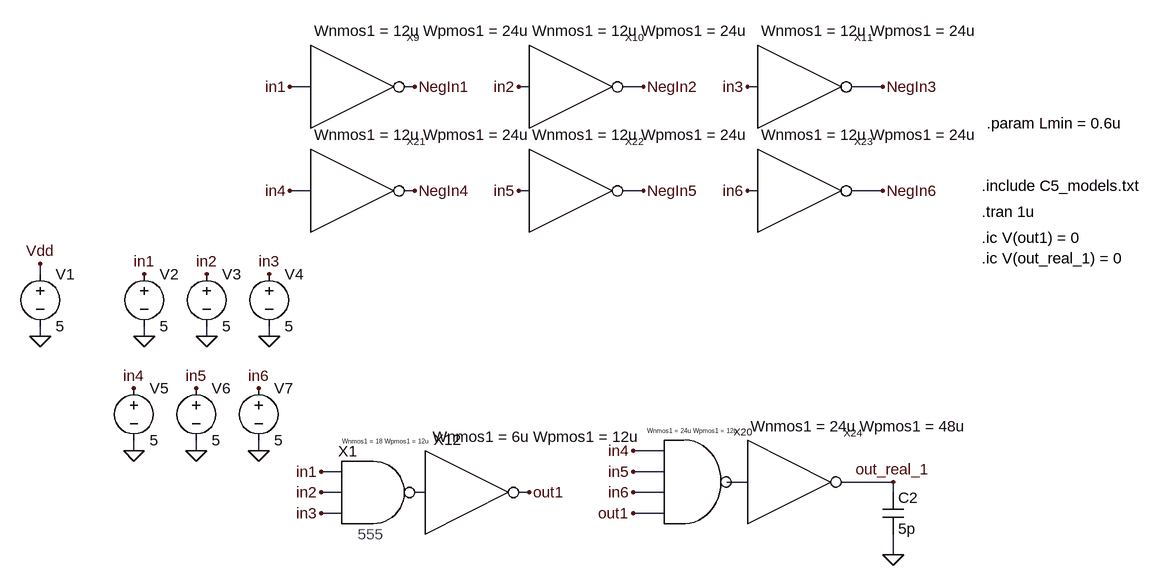
[diagram p0: schematic Decoder.asc]
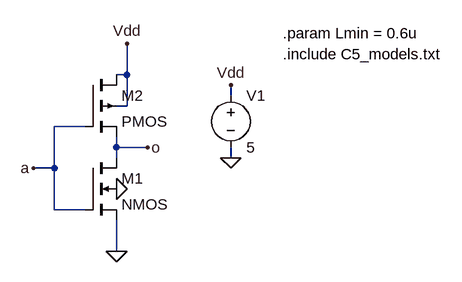
[diagram p1: sub-circuit inv.asc]
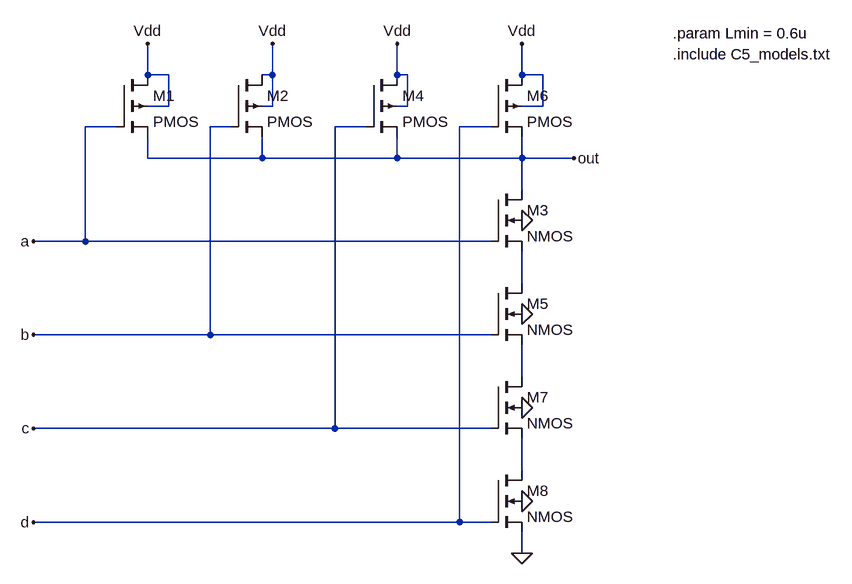
[diagram p2: sub-circuit nand4.asc]
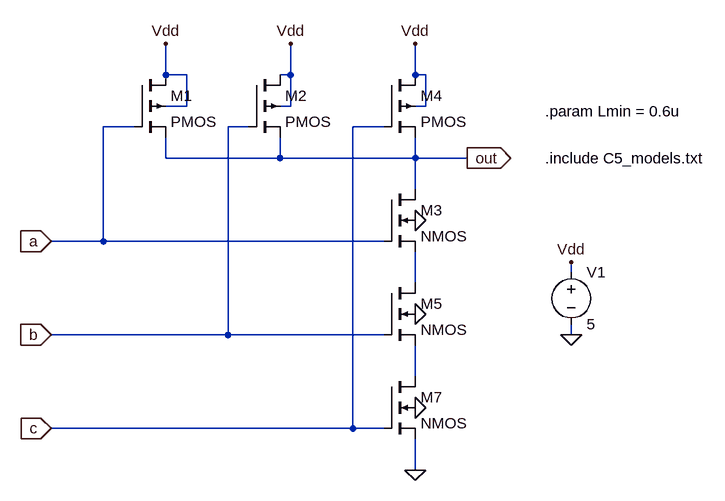
[diagram p3: sub-circuit nand3.asc]
Decoder.asc, the LTspice schematic file:
Version 4
SHEET 1 1096 1028
WIRE -800 -480 -832 -480
WIRE -640 -480 -656 -480
WIRE -464 -480 -480 -480
WIRE -288 -480 -320 -480
WIRE -112 -480 -128 -480
WIRE 80 -480 32 -480
WIRE -800 -320 -832 -320
WIRE -640 -320 -656 -320
WIRE -464 -320 -480 -320
WIRE -288 -320 -320 -320
WIRE -112 -320 -128 -320
WIRE 80 -320 32 -320
WIRE -1216 -192 -1216 -208
WIRE -1216 -96 -1216 -112
WIRE -1056 -96 -1056 -112
WIRE -960 -96 -960 -112
WIRE -864 -96 -864 -112
WIRE -1072 80 -1072 64
WIRE -976 80 -976 64
WIRE -880 80 -880 64
WIRE -256 80 -304 80
WIRE -752 112 -784 112
WIRE -256 112 -304 112
WIRE -128 128 -160 128
WIRE 96 128 16 128
WIRE -752 144 -784 144
WIRE -624 144 -640 144
WIRE -464 144 -480 144
WIRE -256 144 -304 144
WIRE 96 144 96 128
WIRE -752 176 -784 176
WIRE -256 176 -304 176
WIRE 96 240 96 208
FLAG -1056 -96 0
FLAG -1056 -192 in1
FLAG -960 -96 0
FLAG -960 -192 in2
FLAG -864 -96 0
FLAG -864 -192 in3
FLAG -464 144 out1
FLAG -784 112 in1
FLAG -784 144 in2
FLAG -784 176 in3
FLAG -1216 -96 0
FLAG -1216 -208 Vdd
FLAG -832 -480 in1
FLAG -640 -480 NegIn1
FLAG -480 -480 in2
FLAG -288 -480 NegIn2
FLAG -128 -480 in3
FLAG 80 -480 NegIn3
FLAG -1072 80 0
FLAG -1072 -16 in4
FLAG -976 80 0
FLAG -976 -16 in5
FLAG -880 80 0
FLAG -880 -16 in6
FLAG -304 80 in4
FLAG -304 112 in5
FLAG -304 144 in6
FLAG -304 176 out1
FLAG 96 128 out_real_1
FLAG -832 -320 in4
FLAG -640 -320 NegIn4
FLAG -480 -320 in5
FLAG -288 -320 NegIn5
FLAG -128 -320 in6
FLAG 80 -320 NegIn6
FLAG 96 240 0
SYMBOL voltage -1056 -208 R0
SYMATTR InstName V2
SYMATTR Value 5
SYMBOL voltage -960 -208 R0
WINDOW 123 0 0 Left 2
WINDOW 39 0 0 Left 2
SYMATTR InstName V3
SYMATTR Value 5
SYMBOL voltage -864 -208 R0
SYMATTR InstName V4
SYMATTR Value 5
SYMBOL voltage -1216 -208 R0
SYMATTR InstName V1
SYMATTR Value 5
SYMBOL INV -752 -480 R0
SYMATTR InstName X9
SYMBOL INV -416 -480 R0
SYMATTR InstName X10
SYMBOL INV -64 -480 R0
SYMATTR InstName X11
SYMBOL voltage -1072 -32 R0
SYMATTR InstName V5
SYMATTR Value 5
SYMBOL voltage -976 -32 R0
WINDOW 123 0 0 Left 2
WINDOW 39 0 0 Left 2
SYMATTR InstName V6
SYMATTR Value 5
SYMBOL voltage -880 -32 R0
SYMATTR InstName V7
SYMATTR Value 5
SYMBOL INV -752 -320 R0
SYMATTR InstName X21
SYMBOL INV -416 -320 R0
SYMATTR InstName X22
SYMBOL INV -64 -320 R0
SYMATTR InstName X23
SYMBOL cap 80 144 R0
SYMATTR InstName C2
SYMATTR Value 5p
SYMBOL NAND4 -272 128 R0
SYMATTR SpiceLine Wnmos1 = 24u Wpmos1 = 12u
SYMATTR InstName X20
SYMBOL INV -80 128 R0
SYMATTR InstName X24
SYMATTR SpiceLine Wnmos1 = 24u Wpmos1 = 48u
SYMBOL NAND3 -720 144 R0
SYMATTR InstName X1
SYMATTR SpiceLine Wnmos1 = 18 Wpmos1 = 12u
SYMBOL INV -576 144 R0
WINDOW 0 -35 -81 Left 2
SYMATTR InstName X12
SYMATTR SpiceLine Wnmos1 = 6u Wpmos1 = 12u
TEXT 232 -328 Left 2 !.include C5_models.txt
TEXT 232 -288 Left 2 !.tran 1u
TEXT 240 -424 Left 2 !.param Lmin = 0.6u
TEXT 232 -248 Left 2 !.ic V(out1) = 0
TEXT -728 208 Left 2 ;555
TEXT 232 -216 Left 2 !.ic V(out_real_1) = 0

inv.asc, the sub-circuit schematic file:
Version 4
SHEET 1 936 852
WIRE -240 288 -240 240
WIRE -240 288 -256 288
WIRE -80 320 -80 304
WIRE -240 336 -240 288
WIRE -240 336 -256 336
WIRE -304 368 -352 368
WIRE -256 400 -256 384
WIRE -208 400 -256 400
WIRE -256 416 -256 400
WIRE -80 416 -80 400
WIRE -352 432 -352 368
WIRE -352 432 -384 432
WIRE -352 496 -352 432
WIRE -304 496 -352 496
WIRE -256 560 -256 512
FLAG -256 464 0
FLAG -256 560 0
FLAG -240 240 Vdd
FLAG -384 432 a
FLAG -208 400 o
FLAG -80 416 0
FLAG -80 304 Vdd
SYMBOL nmos4 -304 416 R0
SYMATTR InstName M1
SYMATTR Value2 l='Lmin' w='Wnmos1' ad='Lmin*Wnmos1' as='Lmin*Wnmos1' pd='2*(Lmin+Wnmos1)' ps='2*(Lmin+Wnmos1)' m=1
SYMBOL pmos4 -304 288 R0
SYMATTR InstName M2
SYMATTR Value2 l='Lmin' w='Wpmos1' ad='Lmin*Wpmos1' as='Lmin*Wpmos1' pd='2*(Lmin+Wpmos1)' ps='2*(Lmin+Wpmos1)' m=1
SYMBOL voltage -80 304 R0
SYMATTR InstName V1
SYMATTR Value 5
TEXT 0 256 Left 2 !.include C5_models.txt
TEXT 0 224 Left 2 !.param Lmin = 0.6u

nand4.asc, the sub-circuit schematic file:
Version 4
SHEET 1 936 852
WIRE -576 96 -576 48
WIRE -544 96 -576 96
WIRE -384 96 -384 48
WIRE -384 96 -400 96
WIRE -192 96 -192 48
WIRE -176 96 -192 96
WIRE 0 96 0 48
WIRE 32 96 0 96
WIRE -544 144 -544 96
WIRE -544 144 -576 144
WIRE -384 144 -384 96
WIRE -384 144 -400 144
WIRE -176 144 -176 96
WIRE -176 144 -192 144
WIRE 32 144 32 96
WIRE 32 144 0 144
WIRE -624 176 -672 176
WIRE -448 176 -480 176
WIRE -240 176 -288 176
WIRE -48 176 -96 176
WIRE -576 224 -576 192
WIRE -400 224 -400 192
WIRE -400 224 -576 224
WIRE -192 224 -192 192
WIRE -192 224 -400 224
WIRE 0 224 0 192
WIRE 0 224 -192 224
WIRE 80 224 0 224
WIRE 0 272 0 224
WIRE -672 352 -672 176
WIRE -672 352 -752 352
WIRE -48 352 -672 352
WIRE 0 416 0 368
WIRE -480 496 -480 176
WIRE -480 496 -752 496
WIRE -48 496 -480 496
WIRE 0 560 0 512
WIRE -288 640 -288 176
WIRE -288 640 -752 640
WIRE -48 640 -288 640
WIRE 0 704 0 656
WIRE -96 784 -96 176
WIRE -96 784 -752 784
WIRE -48 784 -96 784
WIRE 0 832 0 800
FLAG -384 48 Vdd
FLAG -192 48 Vdd
FLAG 0 48 Vdd
FLAG -576 48 Vdd
FLAG 0 832 0
FLAG 0 752 0
FLAG 0 608 0
FLAG 0 464 0
FLAG 0 320 0
FLAG 80 224 out
FLAG -752 352 a
FLAG -752 496 b
FLAG -752 640 c
FLAG -752 784 d
SYMBOL pmos4 -448 96 R0
SYMATTR InstName M2
SYMATTR Value2 l='Lmin' w='Wpmos1' ad='Lmin*Wpmos1' as='Lmin*Wpmos1' pd='2*(Lmin+Wpmos1)' ps='2*(Lmin+Wpmos1)' m=1
SYMBOL pmos4 -240 96 R0
SYMATTR InstName M4
SYMATTR Value2 l='Lmin' w='Wpmos1' ad='Lmin*Wpmos1' as='Lmin*Wpmos1' pd='2*(Lmin+Wpmos1)' ps='2*(Lmin+Wpmos1)' m=1
SYMBOL pmos4 -48 96 R0
SYMATTR InstName M6
SYMATTR Value2 l='Lmin' w='Wpmos1' ad='Lmin*Wpmos1' as='Lmin*Wpmos1' pd='2*(Lmin+Wpmos1)' ps='2*(Lmin+Wpmos1)' m=1
SYMBOL pmos4 -624 96 R0
SYMATTR InstName M1
SYMATTR Value2 l='Lmin' w='Wpmos1' ad='Lmin*Wpmos1' as='Lmin*Wpmos1' pd='2*(Lmin+Wpmos1)' ps='2*(Lmin+Wpmos1)' m=1
SYMBOL nmos4 -48 272 R0
SYMATTR InstName M3
SYMATTR Value2 l='Lmin' w='Wnmos1' ad='Lmin*Wnmos1' as='Lmin*Wnmos1' pd='2*(Lmin+Wnmos1)' ps='2*(Lmin+Wnmos1)' m=1
SYMBOL nmos4 -48 416 R0
SYMATTR InstName M5
SYMATTR Value2 l='Lmin' w='Wnmos1' ad='Lmin*Wnmos1' as='Lmin*Wnmos1' pd='2*(Lmin+Wnmos1)' ps='2*(Lmin+Wnmos1)' m=1
SYMBOL nmos4 -48 560 R0
SYMATTR InstName M7
SYMATTR Value2 l='Lmin' w='Wnmos1' ad='Lmin*Wnmos1' as='Lmin*Wnmos1' pd='2*(Lmin+Wnmos1)' ps='2*(Lmin+Wnmos1)' m=1
SYMBOL nmos4 -48 704 R0
SYMATTR InstName M8
SYMATTR Value2 l='Lmin' w='Wnmos1' ad='Lmin*Wnmos1' as='Lmin*Wnmos1' pd='2*(Lmin+Wnmos1)' ps='2*(Lmin+Wnmos1)' m=1
TEXT 232 64 Left 2 !.include C5_models.txt
TEXT 232 32 Left 2 !.param Lmin = 0.6u

nand3.asc, the sub-circuit schematic file:
Version 4
SHEET 1 936 852
WIRE -576 96 -576 48
WIRE -544 96 -576 96
WIRE -384 96 -384 48
WIRE -384 96 -400 96
WIRE -192 96 -192 48
WIRE -176 96 -192 96
WIRE -544 144 -544 96
WIRE -544 144 -576 144
WIRE -384 144 -384 96
WIRE -384 144 -400 144
WIRE -176 144 -176 96
WIRE -176 144 -192 144
WIRE -624 176 -672 176
WIRE -448 176 -480 176
WIRE -240 176 -288 176
WIRE -576 224 -576 192
WIRE -400 224 -400 192
WIRE -400 224 -576 224
WIRE -192 224 -192 192
WIRE -192 224 -400 224
WIRE -112 224 -192 224
WIRE -192 272 -192 224
WIRE -672 352 -672 176
WIRE -672 352 -752 352
WIRE -240 352 -672 352
WIRE 48 400 48 384
WIRE -192 416 -192 368
WIRE -480 496 -480 176
WIRE -480 496 -752 496
WIRE -240 496 -480 496
WIRE 48 496 48 480
WIRE -192 560 -192 512
WIRE -288 640 -288 176
WIRE -288 640 -752 640
WIRE -240 640 -288 640
WIRE -192 704 -192 656
FLAG -384 48 Vdd
FLAG -192 48 Vdd
FLAG -576 48 Vdd
FLAG -192 608 0
FLAG -192 464 0
FLAG -192 320 0
FLAG -112 224 out
IOPIN -112 224 Out
FLAG -752 352 a
IOPIN -752 352 In
FLAG -752 496 b
IOPIN -752 496 In
FLAG -752 640 c
IOPIN -752 640 In
FLAG -192 704 0
FLAG 48 496 0
FLAG 48 384 Vdd
SYMBOL pmos4 -448 96 R0
SYMATTR InstName M2
SYMATTR Value2 l='Lmin' w='Wpmos1' ad='Lmin*Wpmos1' as='Lmin*Wpmos1' pd='2*(Lmin+Wpmos1)' ps='2*(Lmin+Wpmos1)' m=1
SYMBOL pmos4 -240 96 R0
SYMATTR InstName M4
SYMATTR Value2 l='Lmin' w='Wpmos1' ad='Lmin*Wpmos1' as='Lmin*Wpmos1' pd='2*(Lmin+Wpmos1)' ps='2*(Lmin+Wpmos1)' m=1
SYMBOL pmos4 -624 96 R0
SYMATTR InstName M1
SYMATTR Value2 l='Lmin' w='Wpmos1' ad='Lmin*Wpmos1' as='Lmin*Wpmos1' pd='2*(Lmin+Wpmos1)' ps='2*(Lmin+Wpmos1)' m=1
SYMBOL nmos4 -240 272 R0
SYMATTR InstName M3
SYMATTR Value2 l='Lmin' w='Wnmos1' ad='Lmin*Wnmos1' as='Lmin*Wnmos1' pd='2*(Lmin+Wnmos1)' ps='2*(Lmin+Wnmos1)' m=1
SYMBOL nmos4 -240 416 R0
SYMATTR InstName M5
SYMATTR Value2 l='Lmin' w='Wnmos1' ad='Lmin*Wnmos1' as='Lmin*Wnmos1' pd='2*(Lmin+Wnmos1)' ps='2*(Lmin+Wnmos1)' m=1
SYMBOL nmos4 -240 560 R0
SYMATTR InstName M7
SYMATTR Value2 l='Lmin' w='Wnmos1' ad='Lmin*Wnmos1' as='Lmin*Wnmos1' pd='2*(Lmin+Wnmos1)' ps='2*(Lmin+Wnmos1)' m=1
SYMBOL voltage 48 384 R0
SYMATTR InstName V1
SYMATTR Value 5
TEXT 8 224 Left 2 !.include C5_models.txt
TEXT 8 152 Left 2 !.param Lmin = 0.6u

The netlist it stands for:
* Decoder.asc
V2 in1 0 5
V3 in2 0 5
V4 in3 0 5
V1 Vdd 0 5
XX9 in1 NegIn1 inv params: Wnmos1 = 12u Wpmos1 = 24u
XX10 in2 NegIn2 inv params: Wnmos1 = 12u Wpmos1 = 24u
XX11 in3 NegIn3 inv params: Wnmos1 = 12u Wpmos1 = 24u
V5 in4 0 5
V6 in5 0 5
V7 in6 0 5
XX21 in4 NegIn4 inv params: Wnmos1 = 12u Wpmos1 = 24u
XX22 in5 NegIn5 inv params: Wnmos1 = 12u Wpmos1 = 24u
XX23 in6 NegIn6 inv params: Wnmos1 = 12u Wpmos1 = 24u
C2 out_real_1 0 5p
XX20 in4 in5 in6 out1 N001 nand4 params: Wnmos1 = 24u Wpmos1 = 12u
XX24 N001 out_real_1 inv params: Wnmos1 = 24u Wpmos1 = 48u
XX1 in1 in2 in3 N002 nand3 params: Wnmos1 = 18 Wpmos1 = 12u
XX12 N002 out1 inv params: Wnmos1 = 6u Wpmos1 = 12u

* block symbol definitions
.subckt inv a o
M1 o a 0 0 NMOS l='Lmin' w='Wnmos1' ad='Lmin*Wnmos1' as='Lmin*Wnmos1' pd='2*(Lmin+Wnmos1)' ps='2*(Lmin+Wnmos1)' m=1
M2 Vdd a o Vdd PMOS l='Lmin' w='Wpmos1' ad='Lmin*Wpmos1' as='Lmin*Wpmos1' pd='2*(Lmin+Wpmos1)' ps='2*(Lmin+Wpmos1)' m=1
V1 Vdd 0 5
.include C5_models.txt
.param Lmin = 0.6u
.ends inv

.subckt nand4 a b c d out
M2 Vdd b out Vdd PMOS l='Lmin' w='Wpmos1' ad='Lmin*Wpmos1' as='Lmin*Wpmos1' pd='2*(Lmin+Wpmos1)' ps='2*(Lmin+Wpmos1)' m=1
M4 Vdd c out Vdd PMOS l='Lmin' w='Wpmos1' ad='Lmin*Wpmos1' as='Lmin*Wpmos1' pd='2*(Lmin+Wpmos1)' ps='2*(Lmin+Wpmos1)' m=1
M6 Vdd d out Vdd PMOS l='Lmin' w='Wpmos1' ad='Lmin*Wpmos1' as='Lmin*Wpmos1' pd='2*(Lmin+Wpmos1)' ps='2*(Lmin+Wpmos1)' m=1
M1 Vdd a out Vdd PMOS l='Lmin' w='Wpmos1' ad='Lmin*Wpmos1' as='Lmin*Wpmos1' pd='2*(Lmin+Wpmos1)' ps='2*(Lmin+Wpmos1)' m=1
M3 out a N001 0 NMOS l='Lmin' w='Wnmos1' ad='Lmin*Wnmos1' as='Lmin*Wnmos1' pd='2*(Lmin+Wnmos1)' ps='2*(Lmin+Wnmos1)' m=1
M5 N001 b N002 0 NMOS l='Lmin' w='Wnmos1' ad='Lmin*Wnmos1' as='Lmin*Wnmos1' pd='2*(Lmin+Wnmos1)' ps='2*(Lmin+Wnmos1)' m=1
M7 N002 c N003 0 NMOS l='Lmin' w='Wnmos1' ad='Lmin*Wnmos1' as='Lmin*Wnmos1' pd='2*(Lmin+Wnmos1)' ps='2*(Lmin+Wnmos1)' m=1
M8 N003 d 0 0 NMOS l='Lmin' w='Wnmos1' ad='Lmin*Wnmos1' as='Lmin*Wnmos1' pd='2*(Lmin+Wnmos1)' ps='2*(Lmin+Wnmos1)' m=1
.include C5_models.txt
.param Lmin = 0.6u
.ends nand4

.subckt nand3 a b c out
M2 Vdd b out Vdd PMOS l='Lmin' w='Wpmos1' ad='Lmin*Wpmos1' as='Lmin*Wpmos1' pd='2*(Lmin+Wpmos1)' ps='2*(Lmin+Wpmos1)' m=1
M4 Vdd c out Vdd PMOS l='Lmin' w='Wpmos1' ad='Lmin*Wpmos1' as='Lmin*Wpmos1' pd='2*(Lmin+Wpmos1)' ps='2*(Lmin+Wpmos1)' m=1
M1 Vdd a out Vdd PMOS l='Lmin' w='Wpmos1' ad='Lmin*Wpmos1' as='Lmin*Wpmos1' pd='2*(Lmin+Wpmos1)' ps='2*(Lmin+Wpmos1)' m=1
M3 out a N001 0 NMOS l='Lmin' w='Wnmos1' ad='Lmin*Wnmos1' as='Lmin*Wnmos1' pd='2*(Lmin+Wnmos1)' ps='2*(Lmin+Wnmos1)' m=1
M5 N001 b N002 0 NMOS l='Lmin' w='Wnmos1' ad='Lmin*Wnmos1' as='Lmin*Wnmos1' pd='2*(Lmin+Wnmos1)' ps='2*(Lmin+Wnmos1)' m=1
M7 N002 c 0 0 NMOS l='Lmin' w='Wnmos1' ad='Lmin*Wnmos1' as='Lmin*Wnmos1' pd='2*(Lmin+Wnmos1)' ps='2*(Lmin+Wnmos1)' m=1
V1 Vdd 0 5
.include C5_models.txt
.param Lmin = 0.6u
.ends nand3

.model NMOS NMOS
.model PMOS PMOS
.lib standard.mos
.include C5_models.txt
.tran 1u
.param Lmin = 0.6u
.ic V(out1) = 0
* 555
.ic V(out_real_1) = 0
.backanno
.end

* Results of the author's LTspice run, read from the files saved beside the schematic
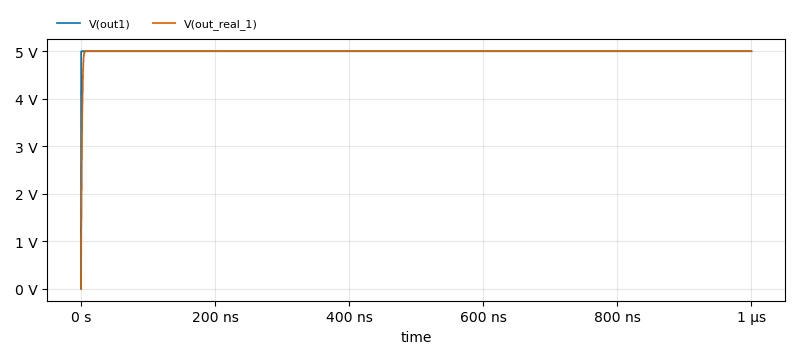
[diagram p4: Transient Analysis of Decoder.asc, plotted from the saved traces]
* Transient Analysis, 1 run:
*   V(out1): min 0 V, max 5 V, average 5 V, rms 5 V, last 5 V
*   V(out_real_1): min 0 V, max 5 V, average 4.993 V, rms 4.995 V, last 5 V